# Altium project CP6AutoV1.0.PrjPCB
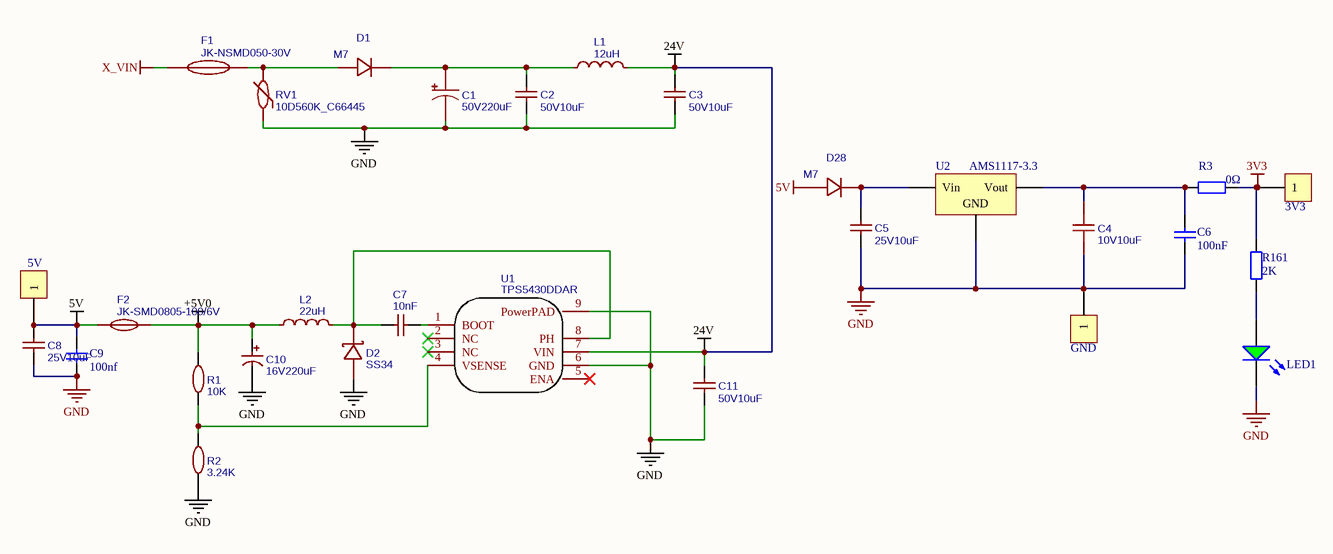
[diagram p0: 1.POWER.SchDoc]
2 sheets, 67 parts. Net scope: flat (ports and power ports of the same name join across sheets).
Board file: ValveDrvBoardV20.PcbDoc
Sheets:
  1.POWER.SchDoc
  2.STM32F107.SchDoc

## Sheet 1.POWER.SchDoc
size A4

### Parts
3V3  TST3V3  [Con-TEST-VCC]  (value not drawn)
5V  TST5V  [Con-TEST-VCC]  (value not drawn)
C1  50V220uF  [CAP-SMD_BD10.0-L10.3-W10.3-FD]
C2  50V10uF  [C1206]
C3  50V10uF  [C1206]
C4  10V10uF  [C0603-M]
C5  25V10uF  [C0805]
C6  100nF  [C0603-M]
C7  10nF  [C0603]
C8  25V10uF  [C0805]
C9  100nF  [C0603-M]
C10  16V220uF  [CAP-SMD_BD6.3-L6.6-W6.6-FD]
C11  50V10uF  [C1206]
D1  M7  [SMA_L4.4-W2.6-LS5.0-RD]
D2  SS34  [SMA_L4.3-W2.6-LS5.2-RD]
D28  M7  [SMA_L4.4-W2.6-LS5.0-RD]
F1  JK-NSMD050-30V  [F1206]
F2  JK-SMD0805-100/6V  [F0805]
GND  GND  [Con-TEST-VCC]  (value not drawn)
L1  12uH  [IND-SMD_L4.0-W4.0_SWPA4018S]
L2  22uH  [IND-SMD_L7.1-W6.6]
LED1  绿灯 0603  [0603_LED_S1]  (value not drawn)
R1  10K  [R0603]
R2  3.24K  [R0603]
R3  0Ω  [R0603-M]
R161  2K  [R0603-M]
RV1  10D560K_C66445  [RES-TH_L12.5-W4.0-P7.50-D1.0]
U1  TPS5430DDAR  [SOIC-8_L5.0-W4.0-P1.27-LS6.0-BL-EP2.0]
U2  AMS1117-3.3  [SOT-223]

### Nets
3V3: 3V3.1 R3.1 R161.2
5V: 5V.1 C8.2 C9.2 D28.2(A) F2.1
24V: C3.2 C11.2 L1.2 U1.7(VIN)
+5V0: C10.1 F2.2 L2.1 R1.2
GND: C1.2 C2.1 C3.1 C4.1 C5.1 C6.1 C8.1 C9.1 C10.2 C11.1 D2.2(A) GND.1 LED1.K R2.1 RV1.1 U1.6(GND) U1.9(PowerPAD) U2.1(GND)
X_VIN: F1.1
NetC1_1: C1.1 C2.2 D1.1(C) L1.1
NetC4_2: C4.2 C6.2 R3.2 U2.2(Vout)
NetC5_2: C5.2 D28.1(C) U2.3(Vin)
NetC7_1: C7.1 D2.1(K) L2.2 U1.8(PH)
NetC7_2: C7.2 U1.1(BOOT)
NetD1_2: D1.2(A) F1.2 RV1.2
NetLED1_A: LED1.A R161.1
NetR1_1: R1.1 R2.2 U1.4(VSENSE)

Not connected (* = marked no-connect by the designer): U1 2(NC)* 3(NC)* 5(ENA)*

### Library data of the parts
3V3 5V GND = CON1: Connector
C1 = 220uF: BOM_Manufacturer: Nichicon; BOM_Manufacturer Part: UWT1H221MNL1GS; nameAlias: Capacitance; Contributor: LCSC; BOM_Supplier: LCSC; BOM_Supplier Part: C125977; BOM_JLCPCB Part Class: Extended Part; spicePre: C; spiceSymbolName: UWT1H221MNL1GS
C2 C3 C11 = 10uF: 贴片电容; BOM_Manufacturer Part: CL31A106KBHNNNE; BOM_Manufacturer: SAMSUNG; nameAlias: Capacitance; BOM_Supplier: LCSC; BOM_Supplier Part: C13585; BOM_JLCPCB Part Class: Basic Part; spicePre: C; spiceSymbolName: CL31A106KBHNNNE
C4 = 10uF: 贴片电容; BOM_Manufacturer: SAMSUNG; BOM_Manufacturer Part: CL10A106KP8NNNC; nameAlias: Capacitance; BOM_Supplier: LCSC; BOM_Supplier Part: C19702; BOM_JLCPCB Part Class: Basic Part; spicePre: C; spiceSymbolName: CL10A106KP8NNNC
C5 C8 = 10uF: 贴片电容; BOM_Manufacturer Part: CL21A106KOQNNNE; BOM_Manufacturer: SAMSUNG; nameAlias: Capacitance; BOM_Supplier: LCSC; BOM_Supplier Part: C15850; BOM_JLCPCB Part Class: Extended Part; spicePre: C; spiceSymbolName: CL21A106KOQNNNE
C6 = Cap Semi: 贴片电容; Published: 8-Jun-2000; LatestRevisionDate: 17-Jul-2002; LatestRevisionNote: Re-released for DXP Platform.; PackageReference: C1206; Publisher: Altium Limited; Value: 100nF
C7 = 10nF: BOM_Manufacturer: FH; BOM_Manufacturer Part: 0603B103K500NT; nameAlias: Capacitance; BOM_Supplier: LCSC; BOM_Supplier Part: C57112; BOM_JLCPCB Part Class: Basic Part; spicePre: C; spiceSymbolName: 0603B103K500NT
C9 = Cap1: Capacitor; Published: 8-Jun-2000; Revision: July-2002: Re-released for DXP Platform.; Publisher: Altium Limited; Value: 100nf
C10 = 220uF: 贴片电解电容; BOM_Manufacturer: CapXon; BOM_Manufacturer Part: ZV221M016E077R; nameAlias: Capacitance; BOM_Supplier: LCSC; BOM_Supplier Part: C65226; BOM_JLCPCB Part Class: Extended Part; spicePre: C; spiceSymbolName: ZV221M016E077R
D1 D28 = M7_C426571: 通用二极管; BOM_Manufacturer: MDD; Contributor: LCSC; BOM_Supplier: LCSC; BOM_Supplier Part: C95872; BOM_Manufacturer Part: M7; BOM_JLCPCB Part Class: Extended Part; spicePre: D; spiceSymbolName: M7_C426571
D2 = B340A: 肖特基二极管; BOM_Manufacturer: MDD; BOM_Supplier: LCSC; BOM_Manufacturer Part: B340A; BOM_Supplier Part: C8678; BOM_JLCPCB Part Class: Extended Part; spicePre: D; spiceSymbolName: B340A
F1 = JK-NSMD050-30V: BOM_Manufacturer: Jinrui Electronic Materials Co.; Contributor: LCSC; BOM_Supplier: LCSC; BOM_Supplier Part: C720075; BOM_Manufacturer Part: JK-NSMD050-30V; BOM_JLCPCB Part Class: Extended Part; spicePre: F; spiceSymbolName: JK-NSMD050-30V
F2 = JK-SMD0805-100/6V: BOM_Manufacturer: JK(金科); Contributor: LCSC; BOM_Supplier: LCSC; BOM_Supplier Part: C2830233; BOM_Manufacturer Part: JK-SMD0805-100/6V; BOM_JLCPCB Part Class: Extended Part; spicePre: F; spiceSymbolName: JK-SMD0805-100/6V
L1 = 12uH: BOM_Manufacturer: Sunlord; BOM_Manufacturer Part: SWPA4030S120MT; nameAlias: Inductance; Contributor: LCSC; BOM_Supplier: LCSC; BOM_Supplier Part: C96892; BOM_JLCPCB Part Class: Extended Part; spicePre: L; spiceSymbolName: SWPA4030S120MT
L2 = 22uH: BOM_Manufacturer: YJYCOIN; BOM_Manufacturer Part: YSPI0630A-220M; nameAlias: Inductance; Contributor: LCSC; BOM_Supplier: LCSC; BOM_Supplier Part: C497873; BOM_JLCPCB Part Class: Extended Part; spicePre: L; spiceSymbolName: YSPI0630A-220M
LED1 = 0603 绿灯: 发光二极管; ComponentLink1Description: 供应商链接; ComponentLink1URL: http://www.szlcsc.com/product/details_73152.html; Package: 0603; Supplier: LC; SuppliersPartNumber: C72043; Value: 绿灯 0603
R1 = 10kΩ: BOM_Manufacturer: UniOhm; BOM_Manufacturer Part: 0603WAF1002T5E; nameAlias: Resistance; BOM_Supplier: LCSC; BOM_Supplier Part: C25804; Resistance (Ohms): 10K; BOM_JLCPCB Part Class: Basic Part; spicePre: R; spiceSymbolName: 0603WAF1002T5E
R2 = 3.24kΩ: BOM_Manufacturer: UniOhm; BOM_Manufacturer Part: 0603WAF3241T5E; nameAlias: Resistance; BOM_Supplier: LCSC; BOM_Supplier Part: C22994; Resistance (Ohms): 3.24K; BOM_JLCPCB Part Class: Extended Part; spicePre: R; spiceSymbolName: 0603WAF3241T5E
R3 = Res2: 贴片电阻/0Ω; Published: 8-Jun-2000; LatestRevisionDate: 17-Jul-2002; LatestRevisionNote: Re-released for DXP Platform.; PackageReference: AXIAL-0.4; Publisher: Altium Limited; Value: 0Ω
R161 = Res2: 贴片电阻; Published: 8-Jun-2000; LatestRevisionDate: 17-Jul-2002; LatestRevisionNote: Re-released for DXP Platform.; PackageReference: AXIAL-0.4; Publisher: Altium Limited; Value: 2K
RV1 = 10D560K_C66445: BOM_Manufacturer: RUILON; BOM_Supplier: LCSC; BOM_Manufacturer Part: 10D560K; BOM_Supplier Part: C66445; BOM_JLCPCB Part Class: Extended Part; spicePre: R; spiceSymbolName: 10D560K_C66445
U1 = TPS5430DDAR: BOM_Manufacturer: TI; SMT Type: Basic; Package Display: No; BOM_Supplier: LCSC; BOM_Manufacturer Part: TPS5430DDAR; BOM_LCSC Assembly: Yes; image: //image.lceda.cn/szlcsc/C9864.jpg; BOM_Supplier Part: C9864; spicePre: U; spiceSymbolName: TPS5430DDAR
U2 = SOT-223 AMS1117-3.3: 低压差线性稳压(LDO); ComponentLink1Description: 供应商链接; ComponentLink1URL: http://www.szlcsc.com/product/details_6652.html; Package: SOT-223; Supplier: LC; SuppliersPartNumber: C6186; Value: AMS1117-3.3

## Sheet 2.STM32F107.SchDoc
size A2
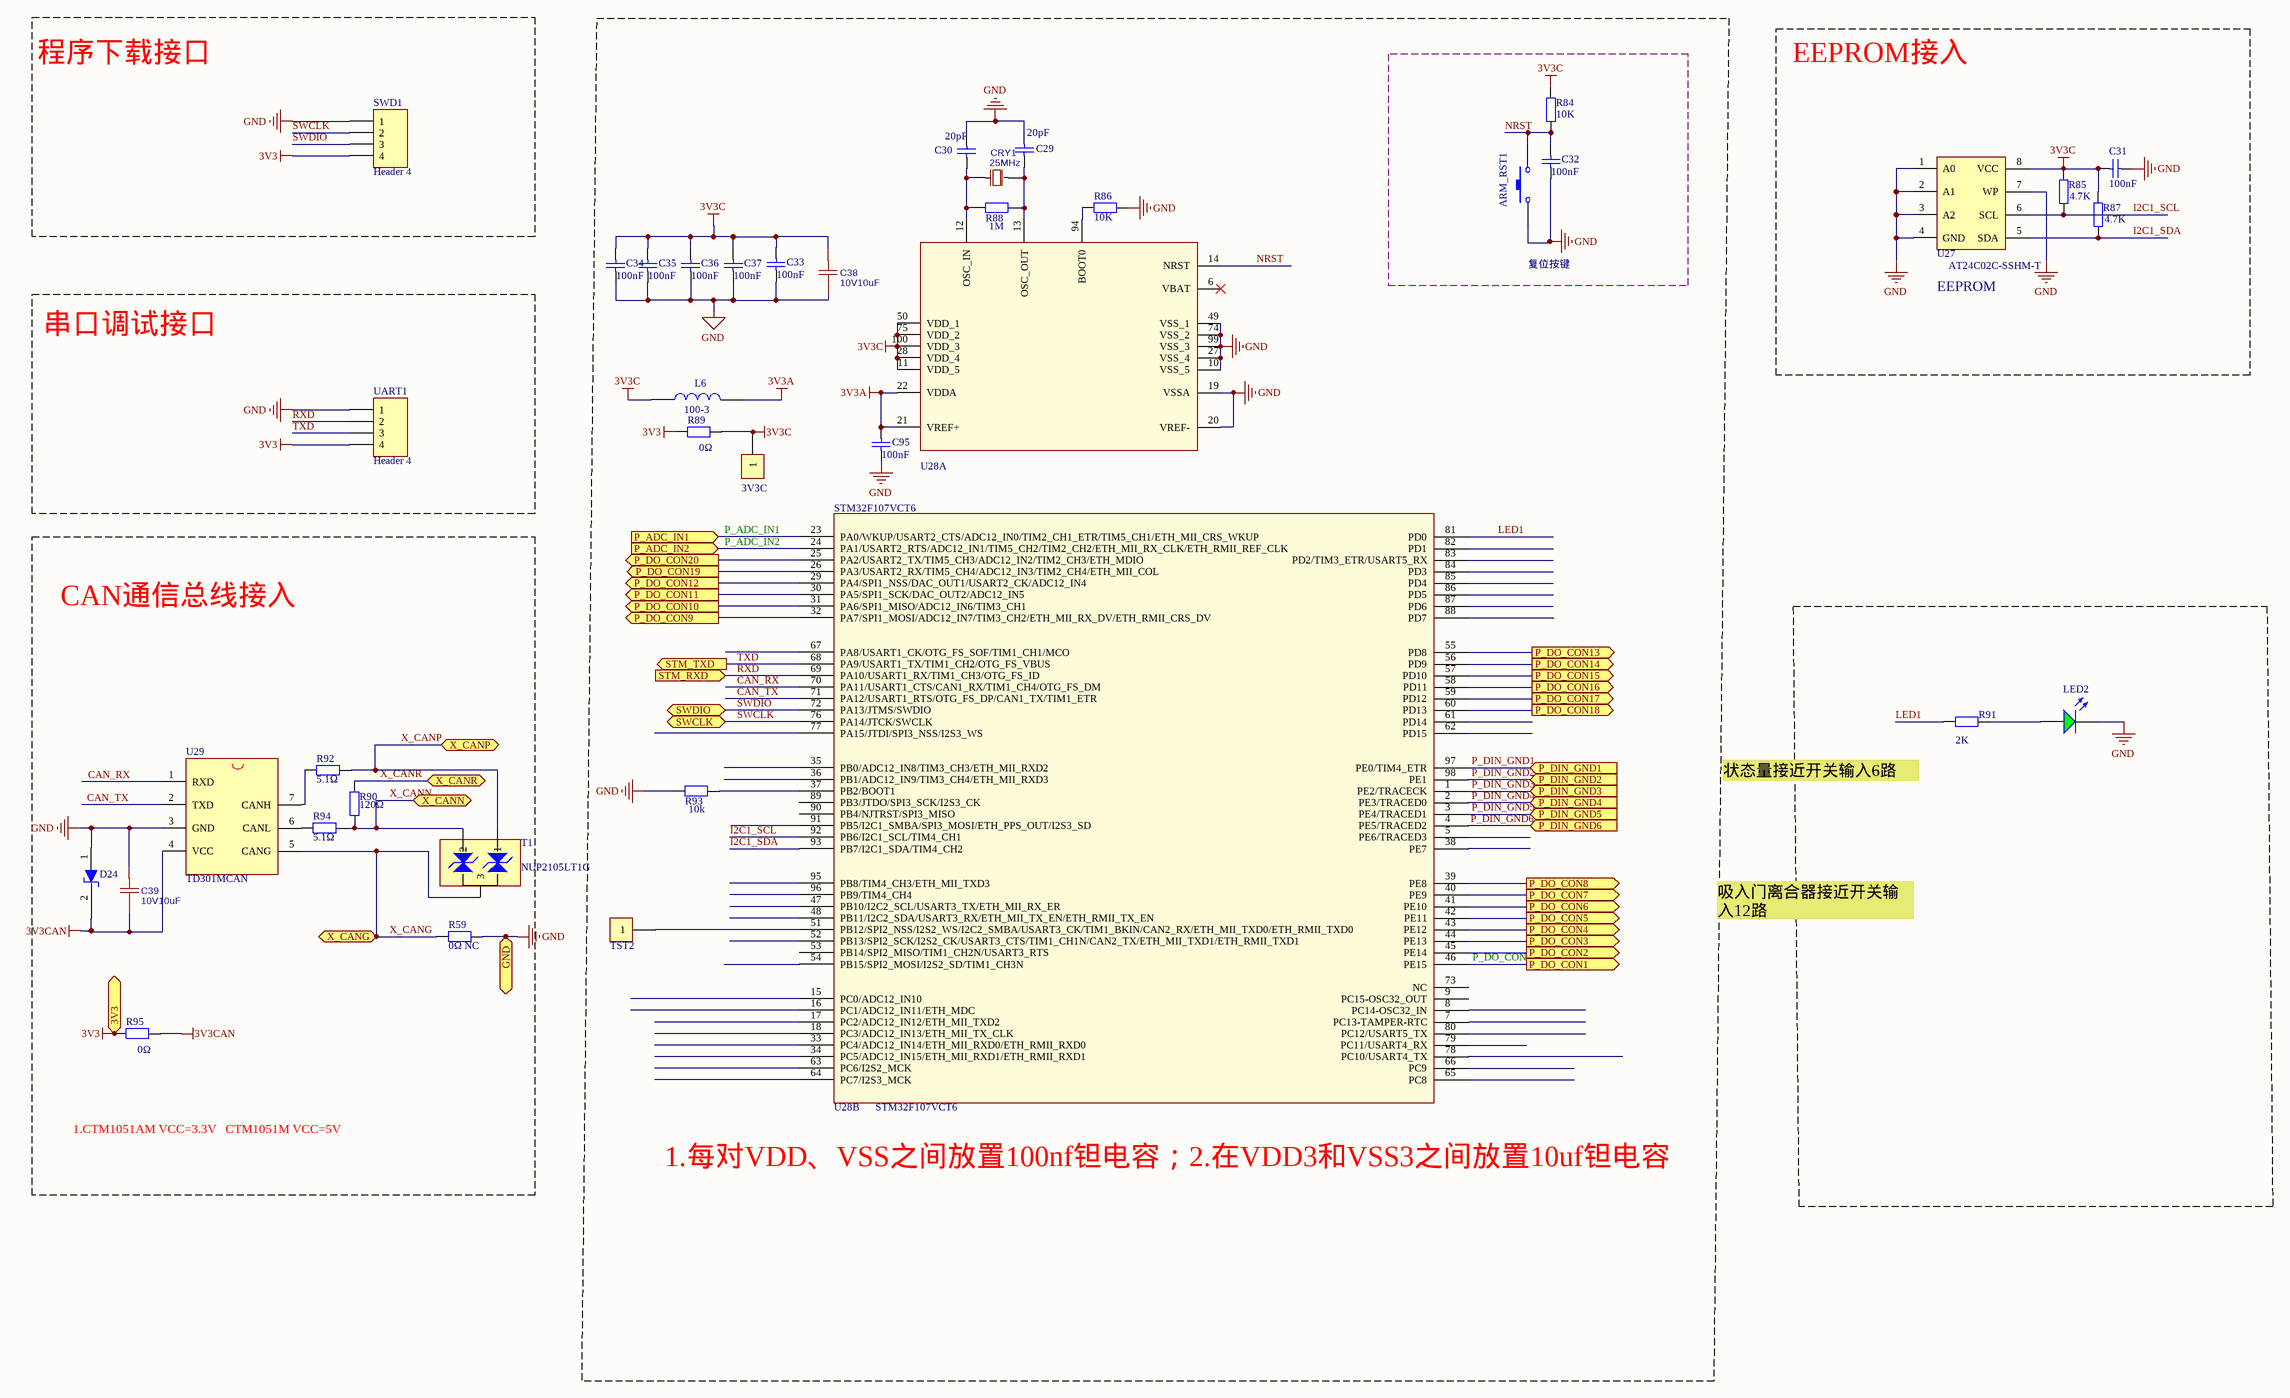
[diagram p1: 2.STM32F107.SchDoc]

### Parts
3V3C  TST3V3C  [Con-TEST-VCC]  (value not drawn)
ARM_RST1  button  [SW_PB2_A1]  (value not drawn)
C29  20pF  [C0603-M]
C30  20pF  [C0603-M]
C31  100nF  [C0603-M]
C32  100nF  [C0603-M]
C33  100nF  [C0603-M]
C34  100nF  [C0603-M]
C35  100nF  [C0603-M]
C36  100nF  [C0603-M]
C37  100nF  [C0603-M]
C38  10V10uF  [C0603-M]
C39  10V10uF  [C0603-M]
C95  100nF  [C0603-M]
CRY1  25MHz  [CRYSTAL-SMD_L11.5-W4.8-LS12.7]
D24  P6SMB6.8CA  [LC-SMA(DO-214AC)_S2]  (value not drawn)
L6  100-3  [L0805-M]
LED2  绿灯 0603  [0603_LED_S1]  (value not drawn)
R59  0Ω NC  [R0603-M]
R84  10K  [R0603-M]
R85  4.7K  [R0603-M]
R86  10K  [R0603-M]
R87  4.7K  [R0603-M]
R88  1M  [R0603-M]
R89  0Ω  [R0603-M]
R90  120Ω  [R0603-M]
R91  2K  [R0603-M]
R92  5.1Ω  [R0603-M]
R93  10k  [R0603-M]
R94  5.1Ω  [R0603-M]
R95  0Ω  [R0603-M]
SWD1  Header 4  [HDR1X4]
T1  NUP2105LT1G  [LC-SOT-23(SOT-23-3)]
TST2  TST3V3A  [Con-TEST-VCC]  (value not drawn)
U27  AT24C02C-SSHM-T  [SO-8]
U28  STM32F107VCT6  [LQFP100]  (value not drawn)  (parts A,B of 2)
U29  TD301MCAN  [LC-DIP-8]
UART1  Header 4  [HDR1X4]

### Blocks framed on the sheet
程序下载接口: SWD1
1.每对VDD、VSS之间放置100nf钽电容；2.在VDD3和VSS3之间放置10uf钽电容: 3V3C C29 C30 C33-C38 C95 CRY1 L6 R86 R88 R89 R93 TST2 U28
EEPROM接入: C31 R85 R87 U27
复位按键: ARM_RST1 C32 R84
串口调试接口: UART1
CAN通信总线接入: C39 D24 R59 R90 R92 R94 R95 T1 U29

### Ports
3V3 (bidir), GND (bidir), P_ADC_IN1 (in), P_ADC_IN2 (in), P_DIN_GND1 (in), P_DIN_GND2 (in), P_DIN_GND3 (in), P_DIN_GND4 (in), P_DIN_GND5 (in), P_DIN_GND6 (in), P_DO_CON1 (out), P_DO_CON2 (out), P_DO_CON3 (out), P_DO_CON4 (out), P_DO_CON5 (out), P_DO_CON6 (out), P_DO_CON7 (out), P_DO_CON8 (out), P_DO_CON9 (out), P_DO_CON10 (out), P_DO_CON11 (out), P_DO_CON12 (out), P_DO_CON13 (out), P_DO_CON14 (out), P_DO_CON15 (out), P_DO_CON16 (out), P_DO_CON17 (out), P_DO_CON18 (out), P_DO_CON19 (out), P_DO_CON20 (out), STM_RXD (in), STM_TXD (out), SWCLK (bidir), SWDIO (bidir), X_CANG (bidir), X_CANN (bidir), X_CANP (bidir), X_CANR (bidir)

### Nets
3V3: R89.1 R95.1 SWD1.4 UART1.4 ; port 3V3
3V3A: C95.2 L6.2 U28.21(VREF+) U28.22(VDDA)
3V3C: 3V3C.1 C31.2 C33.2 C34.2 C35.2 C36.2 C37.2 C38.2 L6.1 R84.2 R85.2 R87.2 R89.2 U27.8(VCC) U28.11(VDD_5) U28.28(VDD_4) U28.50(VDD_1) U28.75(VDD_2) U28.100(VDD_3)
3V3CAN: C39.1 D24.2 R95.2 U29.4(VCC)
GND: ARM_RST1.1 C29.1 C30.2 C31.1 C32.1 C33.1 C34.1 C35.1 C36.1 C37.1 C38.1 C39.2 C95.1 D24.1 LED2.K R59.1 R86.1 R93.2 SWD1.1 U27.1(A0) U27.2(A1) U27.3(A2) U27.4(GND) U27.7(WP) U28.10(VSS_5) U28.19(VSSA) U28.20(VREF-) U28.27(VSS_4) U28.49(VSS_1) U28.74(VSS_2) U28.99(VSS_3) U29.3(GND) UART1.1 ; port GND
CAN_RX: U28.70(PA11/USART1_CTS/CAN1_RX/TIM1_CH4/OTG_FS_DM) U29.1(RXD)
CAN_TX: U28.71(PA12/USART1_RTS/OTG_FS_DP/CAN1_TX/TIM1_ETR) U29.2(TXD)
I2C1_SCL: R85.1 U27.6(SCL) U28.92(PB6/I2C1_SCL/TIM4_CH1)
I2C1_SDA: R87.1 U27.5(SDA) U28.93(PB7/I2C1_SDA/TIM4_CH2)
LED1: R91.1 U28.81(PD0)
NRST: ARM_RST1.2 C32.2 R84.1 U28.14(NRST)
P_ADC_IN1: U28.23(PA0/WKUP/USART2_CTS/ADC12_IN0/TIM2_CH1_ETR/TIM5_CH1/ETH_MII_CRS_WKUP) ; port P_ADC_IN1
P_ADC_IN2: U28.24(PA1/USART2_RTS/ADC12_IN1/TIM5_CH2/TIM2_CH2/ETH_MII_RX_CLK/ETH_RMII_REF_CLK) ; port P_ADC_IN2
P_DIN_GND1: U28.97(PE0/TIM4_ETR) ; port P_DIN_GND1
P_DIN_GND2: U28.98(PE1) ; port P_DIN_GND2
P_DIN_GND3: U28.1(PE2/TRACECK) ; port P_DIN_GND3
P_DIN_GND4: U28.2(PE3/TRACED0) ; port P_DIN_GND4
P_DIN_GND5: U28.3(PE4/TRACED1) ; port P_DIN_GND5
P_DIN_GND6: U28.4(PE5/TRACED2) ; port P_DIN_GND6
P_DO_CON1: U28.46(PE15) ; port P_DO_CON1
RXD: U28.69(PA10/USART1_RX/TIM1_CH3/OTG_FS_ID) UART1.2 ; port STM_RXD
SWCLK: SWD1.2 U28.76(PA14/JTCK/SWCLK) ; port SWCLK
SWDIO: SWD1.3 U28.72(PA13/JTMS/SWDIO) ; port SWDIO
TXD: U28.68(PA9/USART1_TX/TIM1_CH2/OTG_FS_VBUS) UART1.3 ; port STM_TXD
X_CANG: R59.2 T1.3 U29.5(CANG) ; port X_CANG
X_CANN: R90.2 R94.1 T1.2 ; port X_CANN
X_CANP: R92.1 T1.1 ; port X_CANP
X_CANR: R90.1 ; port X_CANR
NetC29_2: C29.2 CRY1.2(OSC2) R88.1 U28.13(OSC_OUT)
NetC30_1: C30.1 CRY1.1(OSC1) R88.2 U28.12(OSC_IN)
NetLED2_A: LED2.A R91.2
NetR86_2: R86.2 U28.94(BOOT0)
NetR92_2: R92.2 U29.7(CANH)
NetR93_1: R93.1 U28.37(PB2/BOOT1)
NetR94_2: R94.2 U29.6(CANL)
NetTST2_1: TST2.1 U28.51(PB12/SPI2_NSS/I2S2_WS/I2C2_SMBA/USART3_CK/TIM1_BKIN/CAN2_RX/ETH_MII_TXD0/ETH_RMII_TXD0)
NetU28_25: U28.25(PA2/USART2_TX/TIM5_CH3/ADC12_IN2/TIM2_CH3/ETH_MDIO) ; port P_DO_CON20
NetU28_26: U28.26(PA3/USART2_RX/TIM5_CH4/ADC12_IN3/TIM2_CH4/ETH_MII_COL) ; port P_DO_CON19
NetU28_29: U28.29(PA4/SPI1_NSS/DAC_OUT1/USART2_CK/ADC12_IN4) ; port P_DO_CON12
NetU28_30: U28.30(PA5/SPI1_SCK/DAC_OUT2/ADC12_IN5) ; port P_DO_CON11
NetU28_31: U28.31(PA6/SPI1_MISO/ADC12_IN6/TIM3_CH1) ; port P_DO_CON10
NetU28_32: U28.32(PA7/SPI1_MOSI/ADC12_IN7/TIM3_CH2/ETH_MII_RX_DV/ETH_RMII_CRS_DV) ; port P_DO_CON9
NetU28_39: U28.39(PE8) ; port P_DO_CON8
NetU28_40: U28.40(PE9) ; port P_DO_CON7
NetU28_41: U28.41(PE10) ; port P_DO_CON6
NetU28_42: U28.42(PE11) ; port P_DO_CON5
NetU28_43: U28.43(PE12) ; port P_DO_CON4
NetU28_44: U28.44(PE13) ; port P_DO_CON3
NetU28_45: U28.45(PE14) ; port P_DO_CON2
NetU28_55: U28.55(PD8) ; port P_DO_CON13
NetU28_56: U28.56(PD9) ; port P_DO_CON14
NetU28_57: U28.57(PD10) ; port P_DO_CON15
NetU28_58: U28.58(PD11) ; port P_DO_CON16
NetU28_59: U28.59(PD12) ; port P_DO_CON17
NetU28_60: U28.60(PD13) ; port P_DO_CON18

Not connected (* = marked no-connect by the designer): U28 5(PE6/TRACED3) 6(VBAT)* 7(PC13-TAMPER-RTC) 8(PC14-OSC32_IN) 9(PC15-OSC32_OUT) 15(PC0/ADC12_IN10) 16(PC1/ADC12_IN11/ETH_MDC) 17(PC2/ADC12_IN12/ETH_MII_TXD2) 18(PC3/ADC12_IN13/ETH_MII_TX_CLK) 33(PC4/ADC12_IN14/ETH_MII_RXD0/ETH_RMII_RXD0) 34(PC5/ADC12_IN15/ETH_MII_RXD1/ETH_RMII_RXD1) 35(PB0/ADC12_IN8/TIM3_CH3/ETH_MII_RXD2) 36(PB1/ADC12_IN9/TIM3_CH4/ETH_MII_RXD3) 38(PE7) 47(PB10/I2C2_SCL/USART3_TX/ETH_MII_RX_ER) 48(PB11/I2C2_SDA/USART3_RX/ETH_MII_TX_EN/ETH_RMII_TX_EN) 52(PB13/SPI2_SCK/I2S2_CK/USART3_CTS/TIM1_CH1N/CAN2_TX/ETH_MII_TXD1/ETH_RMII_TXD1) 53(PB14/SPI2_MISO/TIM1_CH2N/USART3_RTS) 54(PB15/SPI2_MOSI/I2S2_SD/TIM1_CH3N) 61(PD14) 62(PD15) 63(PC6/I2S2_MCK) 64(PC7/I2S3_MCK) 65(PC8) 66(PC9) 67(PA8/USART1_CK/OTG_FS_SOF/TIM1_CH1/MCO) 73(NC) 77(PA15/JTDI/SPI3_NSS/I2S3_WS) 78(PC10/USART4_TX) 79(PC11/USART4_RX) 80(PC12/USART5_TX) 82(PD1) 83(PD2/TIM3_ETR/USART5_RX) 84(PD3) 85(PD4) 86(PD5) 87(PD6) 88(PD7) 89(PB3/JTDO/SPI3_SCK/I2S3_CK) 90(PB4/NJTRST/SPI3_MISO) 91(PB5/I2C1_SMBA/SPI3_MOSI/ETH_PPS_OUT/I2S3_SD) 95(PB8/TIM4_CH3/ETH_MII_TXD3) 96(PB9/TIM4_CH4)

### Notes on the sheet
- (near U27) EEPROM
- 状态量接近开关输入6路
- 吸入门离合器接近开关输入12路
- 1.CTM1051AM VCC=3.3V   CTM1051M VCC=5V

### Library data of the parts
3V3C TST2 = CON1: Connector
ARM_RST1 = button: 轻触开关3.6*6.1*2.5; Value: 轻触开关3.6*6.1*2.5
C29-C37 C95 = Cap1: Capacitor; Published: 8-Jun-2000; Revision: July-2002: Re-released for DXP Platform.; Publisher: Altium Limited
  C29 C30: Value: 20pF
  C31-C37 C95: Value: 100nF
C38 C39 = 10uF: as C4 on sheet 1.POWER; BOM_Supplier: LCSC; BOM_Supplier Part: C19702; BOM_JLCPCB Part Class: Basic Part; spicePre: C; spiceSymbolName: CL10A106KP8NNNC
CRY1 = 25MHz: BOM_Manufacturer: YXC; BOM_Manufacturer Part: X49SM25MSD2SC; nameAlias: Frequency; BOM_Supplier: LCSC; BOM_Supplier Part: C14872; BOM_JLCPCB Part Class: Extended Part; spicePre: X; spiceSymbolName: X49SM25MSD2SC
D24 = TVS: TVS二极管/P6SMB6.8CA; Value: TVS
L6 = INDUCTOR: 贴片磁珠/100Ω 3A/0805; Value: GZ2012D101TF
LED2 = 0603 绿灯: 发光二极管; ComponentLink1Description: 供应商链接; ComponentLink1URL: http://www.szlcsc.com/product/details_73152.html; Package: 0603; Supplier: LC; SuppliersPartNumber: C72043; Value: 绿灯 0603
R59 R89 R95 = Res2: Resistor; Published: 8-Jun-2000; LatestRevisionDate: 17-Jul-2002; LatestRevisionNote: Re-released for DXP Platform.; PackageReference: AXIAL-0.4; Publisher: Altium Limited; PackageDescription: Axial Device, Thru-Hole; 2 Leads; 0.4 in Pin Spacing; Value: 0Ω
R84-R88 R91 R93 = RES2: Resistor; Published: 8-Jun-2000; Revision: July-2002: Re-released for DXP Platform.; Publisher: Altium Limited
  R84 R86: Value: 10K
  R88: Value: 1M
  R91: Value: 2K
  R93: Value: 10k
R90 R92 R94 = Res2: 贴片电阻/120Ω; Published: 8-Jun-2000; LatestRevisionDate: 17-Jul-2002; LatestRevisionNote: Re-released for DXP Platform.; PackageReference: AXIAL-0.4; Publisher: Altium Limited; PackageDescription: Axial Device, Thru-Hole; 2 Leads; 0.4 in Pin Spacing
  R92 R94: Value: 5.1Ω
SWD1 UART1 = Header 4: Header, 4-Pin; LatestRevisionDate: 17-Jul-2002; LatestRevisionNote: Re-released for DXP Platform.; Publisher: Altium Limited; Value: Header 4
T1 = TVS2: TVS
U27 = AT24LC02: EEPROM; Value: AT24C02C-SSHM-T
U28 = STM32F107: Value: STM32F107VCT6
U29 = CTM1051AM: 隔离CAN收发器CTM1051AM或TD301MCAN

## Nets that join several sheets
3V3: 1.POWER (3V3.1 R3.1 R161.2), 2.STM32F107 (R89.1 R95.1 SWD1.4 UART1.4)
GND: 1.POWER (18 pins), 2.STM32F107 (33 pins)